# Altium project keyboard.PrjPCB
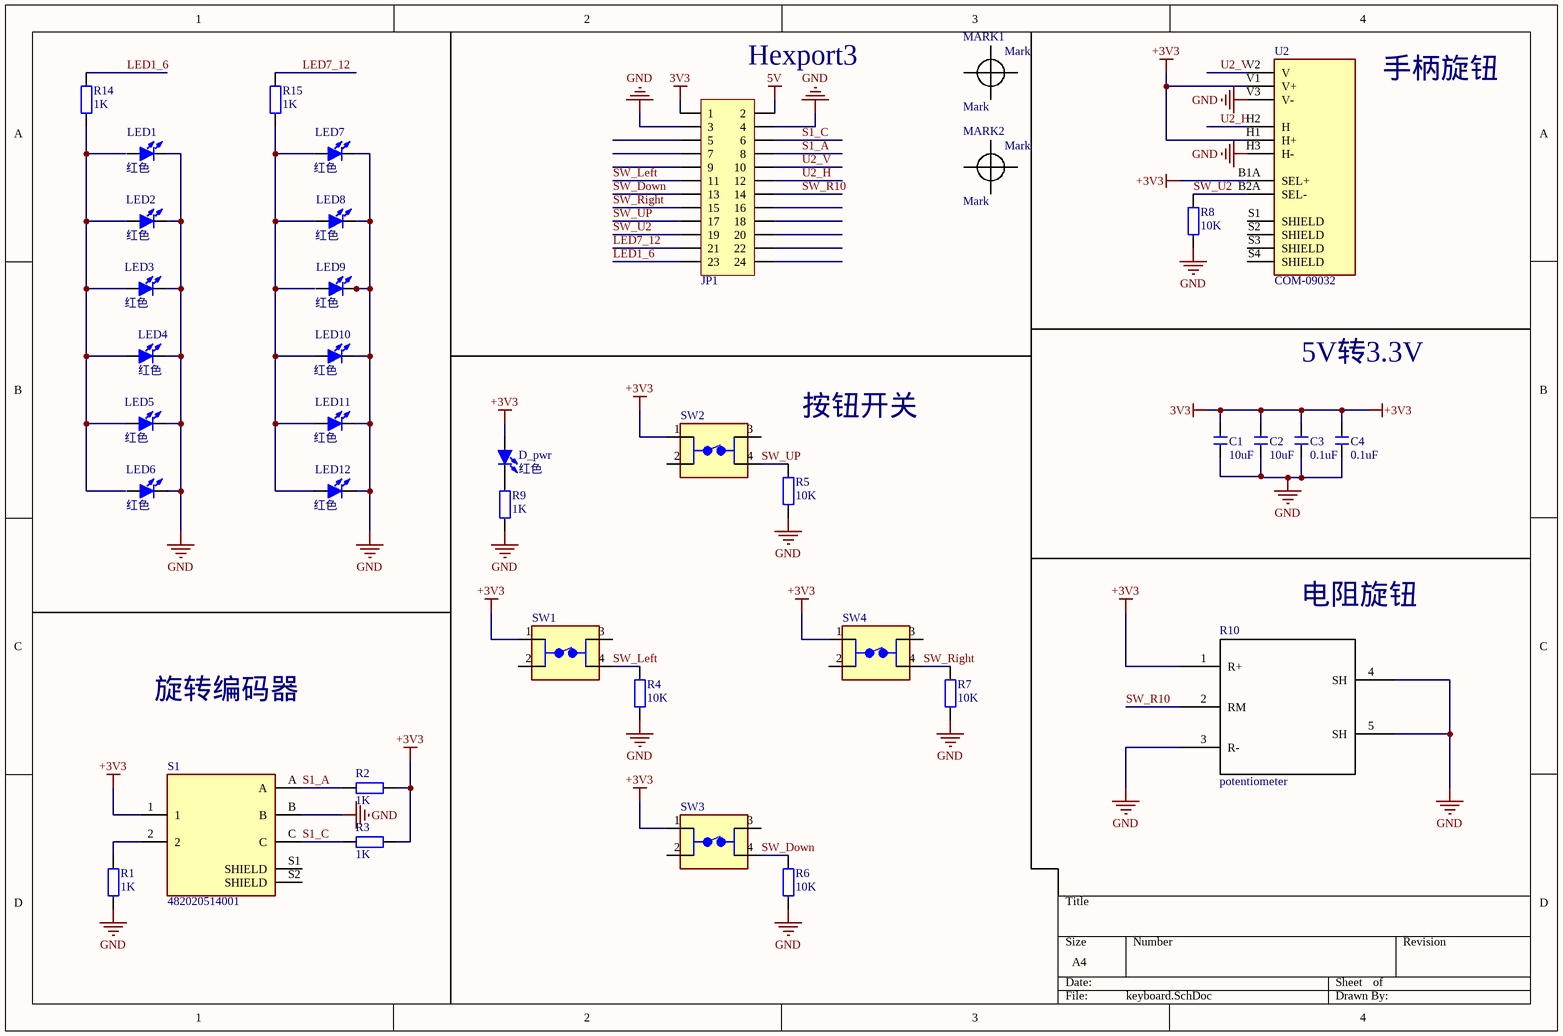
[diagram p0: keyboard.SchDoc]
1 sheet, 38 parts. Net scope: global (net labels, ports and power ports of the same name join across sheets).
Board file: keyboard.PcbDoc

## Sheet keyboard.SchDoc
size A4

### Parts
C1  10uF  [C 0603_L]
C2  10uF  [C 0603_L]
C3  0.1uF  [C 0603_L]
C4  0.1uF  [C 0603_L]
D_pwr  红色  [LED 0603R]
JP1  Header 2X11  [HDR2.54-WI-2x12P]  (value not drawn)
LED1  红色  [LED 0603R]
LED2  红色  [LED 0603R]
LED3  红色  [LED 0603R]
LED4  红色  [LED 0603R]
LED5  红色  [LED 0603R]
LED6  红色  [LED 0603R]
LED7  红色  [LED 0603R]
LED8  红色  [LED 0603R]
LED9  红色  [LED 0603R]
LED10  红色  [LED 0603R]
LED11  红色  [LED 0603R]
LED12  红色  [LED 0603R]
MARK1  Mark  [Mark]  (no BOM)
MARK2  Mark  [Mark]  (no BOM)
R1  1K  [R 0603_L]
R2  1K  [R 0603_L]
R3  1K  [R 0603_L]
R4  10K  [R 0603_L]
R5  10K  [R 0603_L]
R6  10K  [R 0603_L]
R7  10K  [R 0603_L]
R8  10K  [R 0603_L]
R9  1K  [R 0603_L]
R10  potentiometer  [PCBComponent_1 - duplicate]
R14  1K  [R 0603_L]
R15  1K  [R 0603_L]
S1  482020514001  [SW_482020514001]
SW1  4-1437565-1  [TE_FSM4JSMA]  (value not drawn)
SW2  4-1437565-1  [TE_FSM4JSMA]  (value not drawn)
SW3  4-1437565-1  [TE_FSM4JSMA]  (value not drawn)
SW4  4-1437565-1  [TE_FSM4JSMA]  (value not drawn)
U2  COM-09032  [XDCR_COM-09032]

### Nets
5V: JP1.2
+3V3: C1.2 C2.2 C3.2 C4.2 D_pwr.1(A) JP1.1 R2.1 R3.1 R10.1(R+) S1.1 SW1.1 SW2.1 SW3.1 SW4.1 U2.B1A(SEL+) U2.H1(H+) U2.V1(V+)  [also labelled 3V3]
GND: C1.1 C2.1 C3.1 C4.1 JP1.3 JP1.4 LED1.2(K) LED2.2(K) LED3.2(K) LED4.2(K) LED5.2(K) LED6.2(K) LED7.2(K) LED8.2(K) LED9.2(K) LED10.2(K) LED11.2(K) LED12.2(K) R1.2 R4.1 R5.1 R6.1 R7.1 R8.1 R9.1 R10.3(R-) R10.4(SH) R10.5(SH) S1.B U2.H3(H-) U2.V3(V-)
LED1_6: JP1.23 R14.2
LED7_12: JP1.21 R15.2
S1_A: JP1.8 R2.2 S1.A
S1_C: JP1.6 R3.2 S1.C
SW_Down: JP1.13 R6.2 SW3.4
SW_Left: JP1.11 R4.2 SW1.4
SW_R10: JP1.14 R10.2(RM)
SW_Right: JP1.15 R7.2 SW4.4
SW_U2: JP1.19 R8.2 U2.B2A(SEL-)
SW_UP: JP1.17 R5.2 SW2.4
U2_H: JP1.12 U2.H2(H)
U2_V: JP1.10 U2.V2(V)
NetD_pwr_2: D_pwr.2(K) R9.2
NetLED2_1: LED2.1(A) LED3.1(A) LED4.1(A) LED5.1(A) R14.1
NetLED7_1: LED7.1(A) LED8.1(A) LED10.1(A) LED11.1(A) LED12.1(A) R15.1
NetR1_1: R1.1 S1.2

Not connected (* = marked no-connect by the designer): JP1 5 7 9 16 18 20 22 24; LED1 1(A); LED6 1(A); LED9 1(A); S1 S1(SHIELD) S2(SHIELD); SW1 2 3; SW2 2 3; SW3 2 3; SW4 2 3; U2 S1(SHIELD) S2(SHIELD) S3(SHIELD) S4(SHIELD)

### Notes on the sheet
- (near JP1) Hexport3
- 手柄旋钮
- 5V转3.3V
- 按钮开关
- 电阻旋钮
- 旋转编码器

### Library data of the parts
C1-C4 = C: 贴片电容; BOM名称: 无极性贴片电容; 淘宝ID: 封装库来自淘宝 ID：黄晶宝石; 联系售后，技术支持: https://shop463601444.taobao.com; 唯一出售店铺网址: https://shop463601444.taobao.com
D_pwr LED1-LED12 = LED-SMD: 贴片LED; 版权归属: 封装库来自淘宝 ID：黄晶宝石; BOM名称: 贴片LED; 学习资源: https://shop463601444.taobao.com
JP1 = Header 12X2: 12*2P接插件; 版权归属: 封装库来自淘宝卖家 ID：黄晶宝石; BOM名称: 12*2P接插件; 学习资源: https://shop463601444.taobao.com
R1-R9 R14 R15 = R: 贴片电阻; 版权归属: 来自淘宝 ID：黄晶宝石; 封装库来自淘宝卖家 ID：黄晶宝石: 其他店铺购入均为盗版，不享受售后技术支持服务，请立即申请退款; BOM名称: 贴片电阻; 联系售后: https://shop463601444.taobao.com
R10 = R?
S1 = 482020514001: Rotary Encoder Mechanical 20 Quadrature _Incremental_ Vertical; MF: Wurth Electronics; Availability: Unavailable; Price: None; SnapEDA_Link: https://www.snapeda.com/parts/482020514001/Wurth%20Electronics%20Inc./view-part/3661073/?ref=snap; Value: *; MP: 482020514001; Package: None
SW1-SW4 = FSM4JSMA: Tactile Switch SPST-NO Top Actuated Surface Mount; Contact_Current_Rating: 50 mA; Configuration_Pole-Throw: Single Pole - Single Throw; MF: TE Connectivity; SnapEDA_Link: https://www.snapeda.com/parts/FSM4JSMA/TE%20Connectivity%20ALCOSWITCH%20Switches/view-part/543632/?ref=snap; Availability: Unavailable; TE_purchase_URL: https://www.te.com/usa-en/product-4-1437565-1.html?te_bu=Cor&te_type=disp&te_campaign=seda_glo_cor-seda-global-disp-prtnr-fy19-seda-model-bom-cta_sma-317_1&elqCampaignId=32493; MP: FSM4JSMA; EU_RoHS_Compliance: Compliant; Price: None; Package: None; Comment_1: *
  SW1-SW3: Value: *
U2 = COM-09032: Joystick, 2 - Axis Analog _Resistive_ Output; MF: SparkFun Electronics; SnapEDA_Link: https://www.snapeda.com/parts/COM-09032/SparkFun%20Electronics/view-part/888157/?ref=snap; Availability: Unavailable; Value: *; Price: None; MP: COM-09032; Package: SparkFun Electronics